# Altium schematic sheet Schematic_1.SchDoc: Hot End Extension Board
size 431 x 279 mm; DocumentNumber: 0FD2324801; SheetNumber: 1; SheetTotal: 1
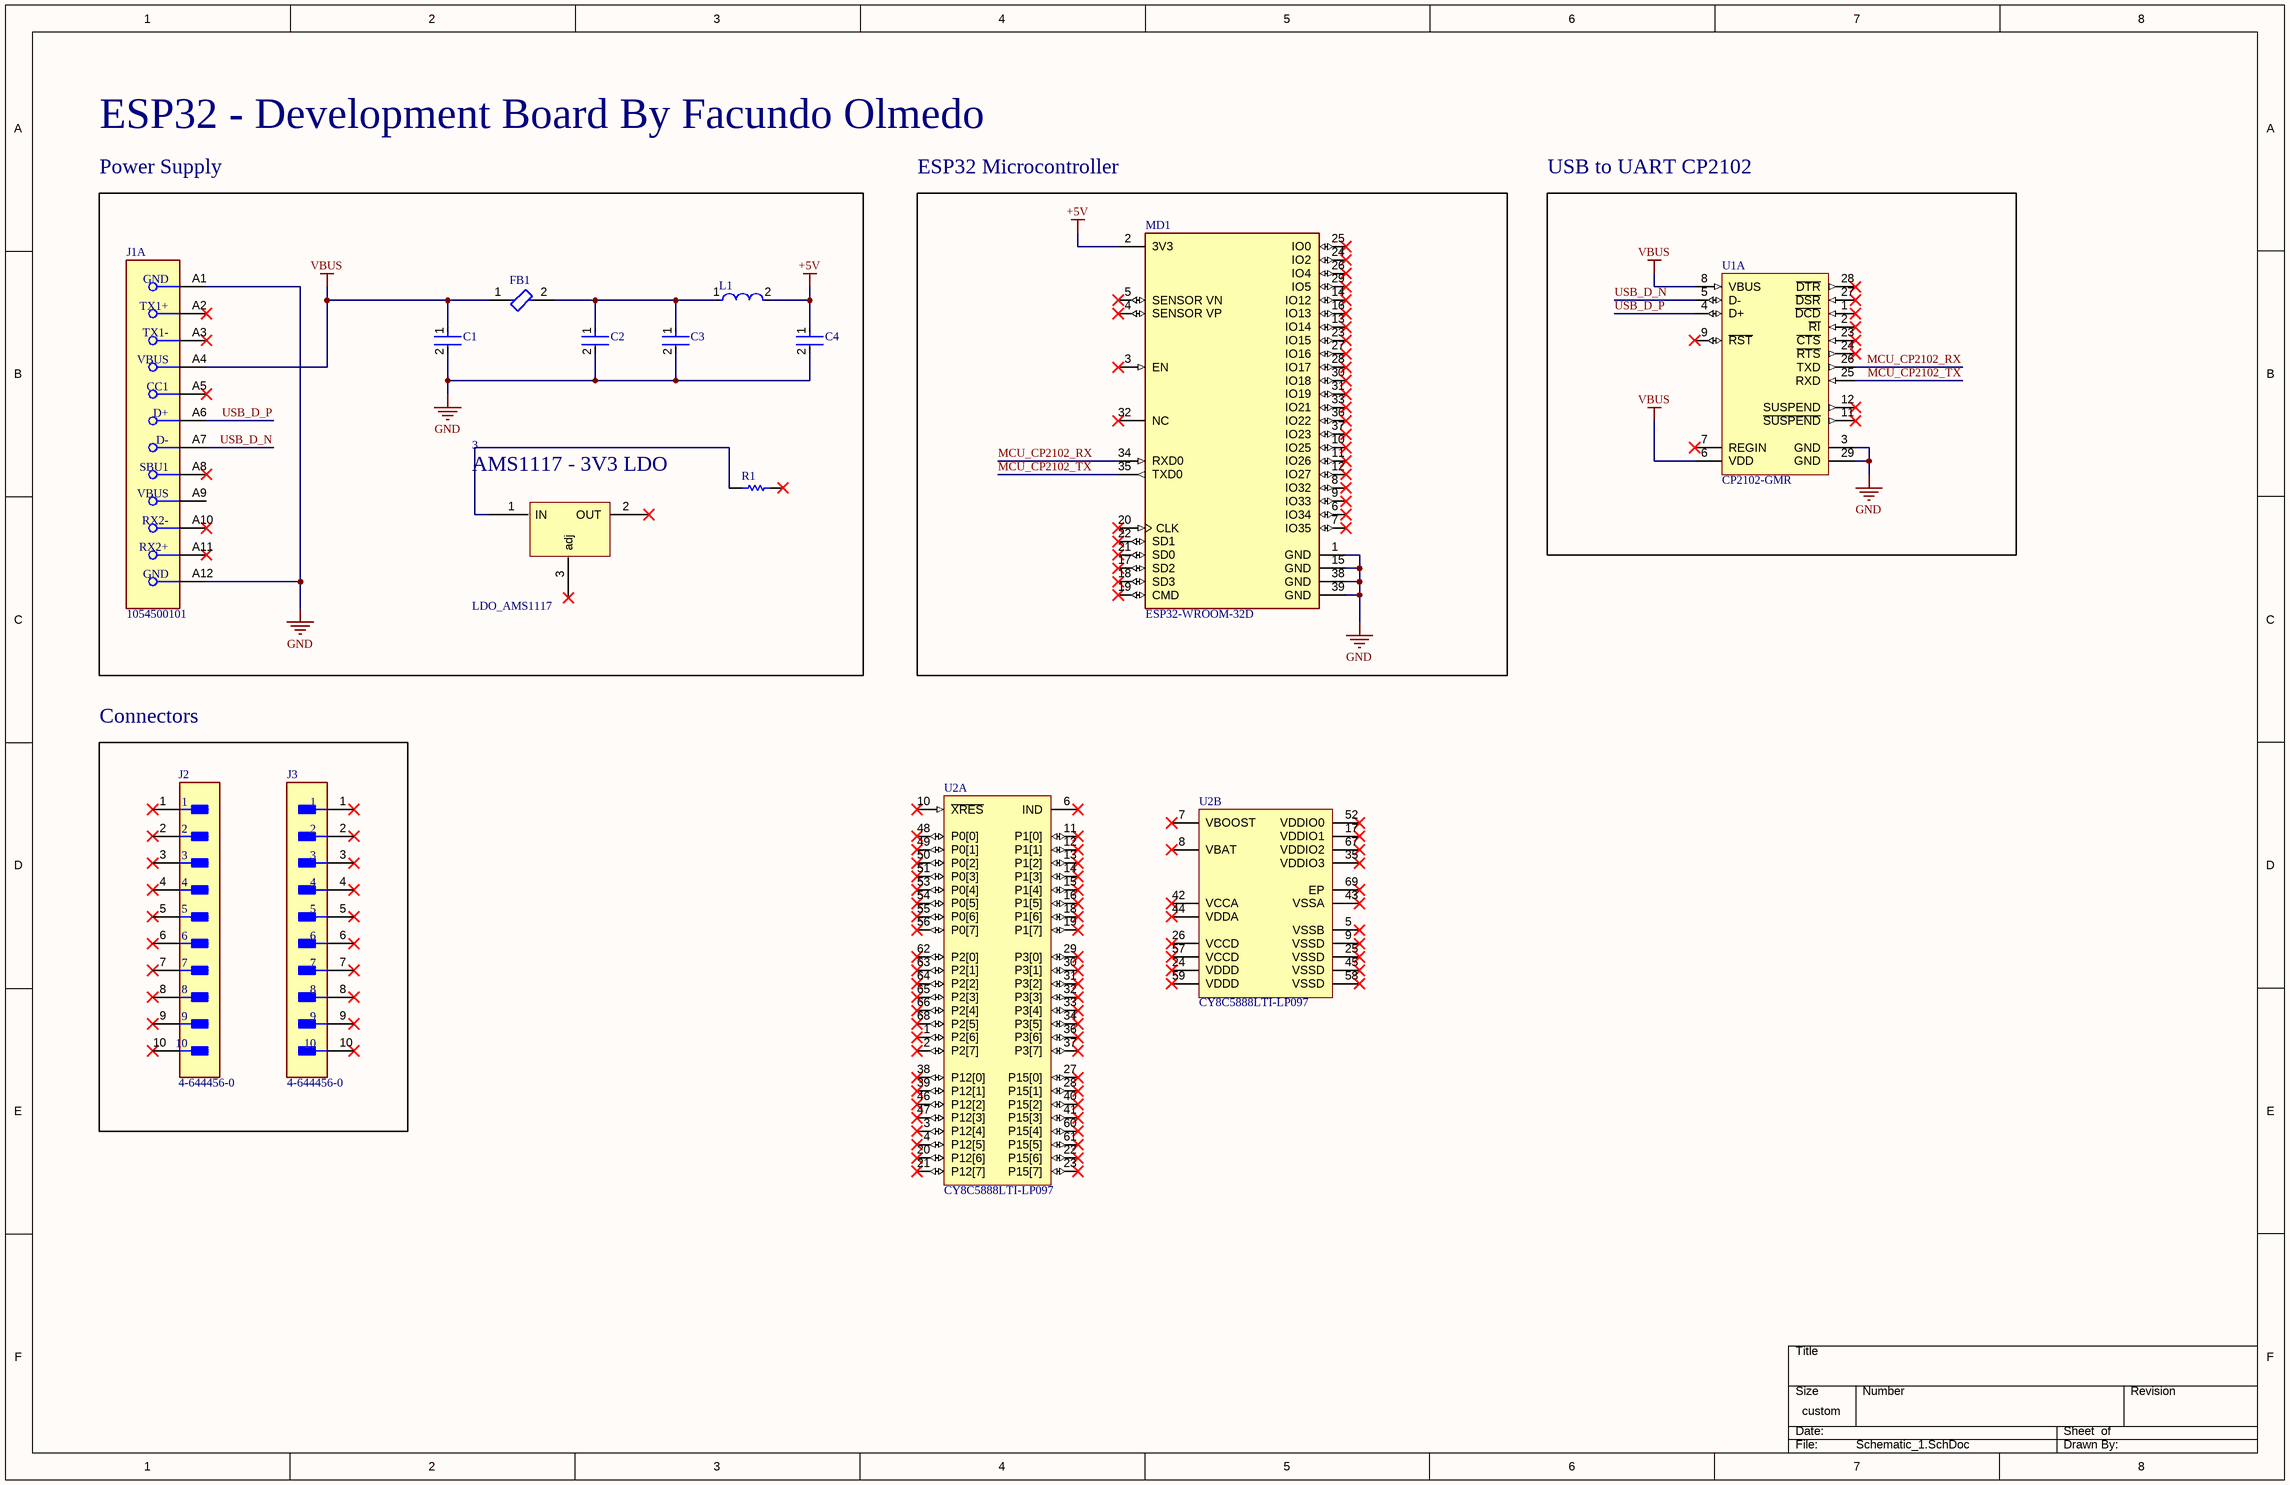
[diagram p0: Schematic_1.SchDoc]

## Parts
3  LDO_AMS1117  [PCBComponent_1]
C1  C0805C104K5RACTU  [FP-C0805C-DN-MFG]  (value not drawn)
C2  C0805C104K5RACTU  [FP-C0805C-DN-MFG]  (value not drawn)
C3  C0805C104K5RACTU  [FP-C0805C-DN-MFG]  (value not drawn)
C4  C0805C104K5RACTU  [FP-C0805C-DN-MFG]  (value not drawn)
FB1  BLM15AG102SN1D  [FP-BLM15-0_05-IPC_B]  (value not drawn)
J1  1054500101  [FP-1054500101-MFG]  (part A of 3)
J2  4-644456-0  [FP-4-644456-0-MFG]
J3  4-644456-0  [FP-4-644456-0-MFG]
L1  LQM21NNR10K10D  [FP-LQM21DN_00-IPC_A]  (value not drawn)
MD1  ESP32-WROOM-32D  [FP-ESP32-WROOM-32D-MFG]
R1  RC0805FR-0710RL  [RESC2013X60X35ML10T20]  (value not drawn)
U1  CP2102-GMR  [SLAB-QFN-28-3125x3125TP_M]  (part A of 2)
U2  CY8C5888LTI-LP097  [CYP-LTX68_M]  (parts A,B of 2)

## Blocks framed on the sheet
Power Supply: 3 C1-C4 FB1 J1 L1 R1
ESP32 Microcontroller: MD1
USB to UART CP2102: U1
Connectors: J2 J3

## Nets
+5V: C4.1 L1.2 MD1.2(3V3)
GND: C1.2 C2.2 C3.2 C4.2 J1.A1(GND) J1.A12(GND) MD1.1(GND) MD1.15(GND) MD1.38(GND) MD1.39(GND) U1.3(GND) U1.29(GND)
VBUS: C1.1 FB1.1 J1.A4(VBUS) U1.6(VDD) U1.8(VBUS)
MCU_CP2102_RX: MD1.34(RXD0) U1.26(TXD)
MCU_CP2102_TX: MD1.35(TXD0) U1.25(RXD)
USB_D_N: J1.A7(D-) U1.5(D-)
USB_D_P: J1.A6(D+) U1.4(D+)
Net3_1: 3.1(IN) R1.1
NetC2_1: C2.1 C3.1 FB1.2 L1.1

Not connected (* = marked no-connect by the designer): 3 2(OUT) 3(adj)*; J1 A2(TX1+)* A3(TX1-)* A5(CC1)* A8(SBU1)* A9(VBUS) A10(RX2-)* A11(RX2+)*; J2 1* 2* 3* 4* 5* 6* 7* 8* 9* 10*; J3 1* 2* 3* 4* 5* 6* 7* 8* 9* 10*; MD1 3(EN)* 4(SENSOR_VP)* 5(SENSOR_VN)* 6(IO34)* 7(IO35)* 8(IO32)* 9(IO33)* 10(IO25)* 11(IO26)* 12(IO27)* 13(IO14)* 14(IO12)* 16(IO13)* 17(SD2)* 18(SD3)* 19(CMD)* 20(CLK)* 21(SD0)* 22(SD1)* 23(IO15)* 24(IO2)* 25(IO0)* 26(IO4)* 27(IO16)* 28(IO17)* 29(IO5)* 30(IO18)* 31(IO19)* 32(NC)* 33(IO21)* 36(IO22)* 37(IO23)*; R1 2*; U1 1(~{DCD})* 2(~{RI})* 7(REGIN)* 9(~{RST})* 11(~{SUSPEND})* 12(SUSPEND)* 23(~{CTS})* 24(~{RTS})* 27(~{DSR})* 28(~{DTR})*; U2 1(P2[6])* 2(P2[7])* 3(P12[4])* 4(P12[5])* 5(VSSB)* 6(IND)* 7(VBOOST)* 8(VBAT)* 9(VSSD)* 10(~{XRES})* 11(P1[0])* 12(P1[1])* 13(P1[2])* 14(P1[3])* 15(P1[4])* 16(P1[5])* 17(VDDIO1)* 18(P1[6])* 19(P1[7])* 20(P12[6])* 21(P12[7])* 22(P15[6])* 23(P15[7])* 24(VDDD)* 25(VSSD)* 26(VCCD)* 27(P15[0])* 28(P15[1])* 29(P3[0])* 30(P3[1])* 31(P3[2])* 32(P3[3])* 33(P3[4])* 34(P3[5])* 35(VDDIO3)* 36(P3[6])* 37(P3[7])* 38(P12[0])* 39(P12[1])* 40(P15[2])* 41(P15[3])* 42(VCCA)* 43(VSSA)* 44(VDDA)* 45(VSSD)* 46(P12[2])* 47(P12[3])* 48(P0[0])* 49(P0[1])* 50(P0[2])* 51(P0[3])* 52(VDDIO0)* 53(P0[4])* 54(P0[5])* 55(P0[6])* 56(P0[7])* 57(VCCD)* 58(VSSD)* 59(VDDD)* 60(P15[4])* 61(P15[5])* 62(P2[0])* 63(P2[1])* 64(P2[2])* 65(P2[3])* 66(P2[4])* 67(VDDIO2)* 68(P2[5])* 69(EP)*

## Notes on the sheet
- ESP32 - Development Board By Facundo Olmedo
- DWG. NO.
- REV.
- SHT.
- THIS DOCUMENT AND THE DATA DISCLOSED HEREIN OR HEREWITH IS THE PROPERTY OF ALTIUM LIMITED AND MAY BE FREELY DISTRIBUTED IN WHOLE. NO RIGHTS ARE RESERVED OR EXPRESS OR IMPLIED WARANTEE GIVEN.
- REVISION
- DESCRIPTION
- DATE
- APPROVED
- ENG:
- APPROVALS
- PROJECT
- DSN:
- CHK:
- REFERENCE DOCUMENTS
- PROJECT REVISION:
- TITLE
- DOCUMENT REVISION:
- DESIGN ITEM:
- BOM:
- FAB DWG:
- PCB DWG:
- ASSY DWG:
- SCALE:
- SIZE
- B
- CAGE CODE
- FILE NAME
- DWG NO.
- SHEET
- OF
- REV
- (in symbol LDO_AMS1117) AMS1117 - 3V3 LDO

## Library data of the parts
C1-C4 = CMP-2007-00279-2: CAP CER 0.1UF 50V X7R 0805; Manufacturer: KEMET; Value: 0.10 μF; Tolerance: 0.1; Temperature Coefficient: 30ppm/°C; Material: Ceramic; Manufacturer Part Number: C0805C104K5RACTU; Device Class L2: Capacitors; Temperature Range Low: -55°C; Voltage Rating: 50 V; Digikey Description: CAP CER 0.1UF 50V X7R 0805; Category: Cap; ComponentLink2Description: Datasheet; Octopart: https://octopart.com/c0805c104k5ractu-kemet-143926; RoHS: TRUE; ComponentLink2URL: https://content.kemet.com/datasheets/KEM_C1003_C0G_SMD.pdf; Temperature Characteristic: X7R; Temperature: -55°C to +125°C; Height: 0.88mm; Temperature Range High: +125°C; Device Class L1: Passive Components; Automotive: No; Lead Free: Yes; Ipc Land Pattern Name: CAPC200125X78; Device Class L3: Ceramic Capacitors; Mouser Description: Cap Ceramic 0.1uF 50V X7R 10% SMD 2.0 x 1.2 mm 125 C Paper T/R; Capacitance: 0.10 μF; Package: C0805C-DN
FB1 = CMP-0686-00181-5: Chip Ferrite Bead, 0402, 1000Ω @ 100MHz, 0.65Ω, 25%, 300mA; DC Current: 200mA; Number of Circuits: 1; Shielding: Unshielded; Impedance: 1kR; DC Resistance (DCR): 650mR; DC Resistance-Max: 1R; Packaging: Tape and Reel; Case Code (Imperial): 0402; Military Standard: Not; Min Operating Temperature: -55°C; Width: 0.5mm; Tolerance: 25%; Material: Ferrite; Number of Lines: 1; Max Current Rating: 300mA; Depth: 0.55mm; Package Quantity: 1; Case/Package: 0402; Series: BLM15AG_SN; Case Code (Metric): 1005; Max Operating Temperature: 125°C; Lead Free: Lead Free; Test Frequency: 100MHz; RoHS Compliant: Yes; Radiation Hardening: No; Number of Pins: 2; Core Material: Ferrite; Current Rating: 300mA; Frequency: 100MHz; Max DC Current: 200mA; REACH SVHC: No SVHC; Length: 1mm; Termination: SMD/SMT; Height: 0.5mm
J1 = CMP-04767-000004-1: CONN RCP USB3.1 TYPEC 24P SMD RA; Manufacturer: Molex; Number Of Contacts: 24; Voltage Rating: 30V; Shielding: true; Is Female: yes; Current Rating: 0.25/1.25/5A; Pitch: 0.5mm; Conn Orientation: Right Angle; Package: 0; Height: 3.44mm; Footprint Url: https://www.molex.com/pdm_docs/sd/1054500101_sd.pdf; Device Class L1: Connectors; Category: Conn; Device Class L2: USB Connectors; Digikey Description: CONN RCP USB3.1 TYPEC 24P SMD RA; Contact Material: Gold,Nickel; Mouser Description: USB Shielded I/O Receptacle; Type C; Right Angle; Surface Mount; Gold over Nickel; ComponentLink2Description: Datasheet; Lead Free: Yes; Automotive: No; Temperature Range High: +85°C; RoHS: TRUE; Octopart: https://octopart.com/105450-0101-molex-68082325; ComponentLink2URL: https://www.molex.com/webdocs/datasheets/pdf/en-us/1054500101_IO_CONNECTORS.pdf; Temperature: -30°C to +85°C; Usb Standard: USB 3.1; Temperature Range Low: -30°C; Device Class L3: unset; Manufacturer Part Number: 1054500101
J2 J3 = CMP-03369-000038-1: CONN HEADER VERT 10POS 2.54MM; Manufacturer: TE Connectivity; Current Rating: 5A; Conn Gender: Male; Number Of Contacts: 10; Conn Orientation: Vertical; Voltage Rating: 250V; Number Of Rows: 1; Device Class L3: unset; Octopart: https://octopart.com/4-644456-0-te+connectivity-39514173; Pitch: 2.54mm; Mouser Description: Headers & Wire Housings NARROW FLT HDR 10P Straight Post; ComponentLink2Description: Datasheet; Height: 0.408inch; Package: 4-644456-0; RoHS: TRUE; Temperature Range High: +105°C; Digikey Description: CONN HEADER VERT 10POS 2.54MM; Temperature: -55°C to +105°C; Device Class L2: Headers and Wire Housings; Automotive: No; Lead Free: Yes; Contact Material: Tin; Manufacturer Part Number: 4-644456-0; Temperature Range Low: -55°C; Footprint Url: https://www.te.com/commerce/DocumentDelivery/DDEController?Action=showdoc&DocId=Customer+Drawing%7F644456%7FD2%7Fpdf%7FEnglish%7FENG_CD_644456_D2.pdf%7F4-644456-0; Device Class L1: Connectors; Category: Conn; ComponentLink2URL: https://www.te.com/commerce/DocumentDelivery/DDEController?Action=showdoc&DocId=Data+Sheet%7F82056_MTA%7F0818%7Fpdf%7FEnglish%7FENG_DS_82056_MTA_0818.pdf%7F4-644456-0
L1 = CMP-2000-06588-2: Multilayer Type Inductor for General Circuits, 0805 (2012), 0.1μH, 10%, 0.26Ω, 250mA; Test Frequency: 25MHz; Inductance: 100nH; Q Factor: 20; Self Resonant Frequency: 340MHz; Shielding: Shielded; Core Material: Ferrite; DC Resistance (DCR): 260mR; Rated Current-Max: 250mA; Tolerance: 10%; DC Current: 250mA; REACH SVHC: No SVHC; Case/Package: 0805; Package Quantity: 4000; Height - Seated (Max): 0.057inch; Packaging: Tape and Reel; Termination: SMD/SMT; RoHS Compliant: Yes; Series: LQM21N; Height: 0.85mm; Case Code (Metric): 2012; Width: 1.25mm; Inductance Tolerance: 10%; Case Code (Imperial): 0805; Radiation Hardening: No; Lead Free: Lead Free; Min Operating Temperature: -40°C; Current Rating: 250mA; Mount: Surface Mount; Max Operating Temperature: 85°C; Length: 2mm; Military Standard: Not; Max DC Current: 250mA; Depth: 1.45mm
MD1 = CMP-194065-000003-1: WIFI MODULE 32MBITS SPI FLASH; Manufacturer: Espressif Systems; Max Supply Voltage: 3.6V; Nominal Supply Current: 500mA; Max Frequency: 2484MHz; Number Of Adc Channels: 16; Number Of Gpio: 32; Interface: I2C,SPI,UART,Ethernet,I2S,Other; Data Rate: 150Mbits/s; Min Supply Voltage: 3V; Bandwidth: 72MHz; Sensitivity: -98dBm; Octopart: https://octopart.com/esp32-wroom-32d-espressif+systems-91040050; Package: ESP32-WROOM-32D; ComponentLink2URL: https://www.espressif.com/sites/default/files/documentation/esp32-wroom-32d_esp32-wroom-32u_datasheet_en.pdf; Lead Free: Yes; Category: UNK; Mouser Description: Wi-Fi/BT BLE Module ESP32-D0WD, SPI Flash, UART, P; Device Class L1: Integrated Circuits (ICs); RoHS: TRUE; Temperature Range Low: -40°C; ComponentLink2Description: Datasheet; Digikey Description: WIFI MODULE 32MBITS SPI FLASH; Height: 3.2mm; Temperature: -40°C to +85°C; Manufacturer Part Number: ESP32-WROOM-32D; Device Class L3: Transceivers; Device Class L2: RF Semiconductors and Devices; Temperature Range High: +85°C; Automotive: No
R1 = CMP-2100-03670-1: Chip Resistor, 10 Ohm, +/- 1%, 0.125 W, -55 to 155 degC, 0805 (2012 Metric), RoHS, Tape and Reel; Manufacturer: Yageo; Resistance: 10Ohm; Power Rating: 125mW; Voltage Rating: 150V; Temperature Coefficient: 200ppm/degreesC; Number of Pins: 2; REACH SVHC: NoSVHC; Datasheet Version: Rev. 5, 10/2016; Max Operating Temperature: 155degC; Manufacturer URL: http://www.yageo.com/; Case Code (Imperial): 0805; Package Description: 2-Pin Surface Mounted Device, Body 2 x 1.25 mm; Case Code (Metric): 2012; Length: 2mm; RoHSCompliant: true; Max Power Dissipation: 125mW; Depth: 1.25mm; Packaging: TapeandReel; Height: 0.5mm; Package Reference: 0805; Package Quantity: 1; Tolerance: 1%; Termination: SMD/SMT; Min Operating Temperature: -55degC; Lead Free: LeadFree; Width: 1.25mm; Voltage Rating (DC): 150V; Datasheet URL: http://www.yageo.com/NewPortal/yageodocoutput?fileName=/pdf/R-Chip/PYu-RC_Group_51_RoHS_L_5.pdf; Composition: ThickFilm; Number of Terminations: 2; Case/Package: 0805
U1 = CMP-2000-04924-1: Single-Chip USB to URAT Bridge, 3.3 V, -40 to 85 degC, 28-Pin QFN, RoHS, Tape and Reel; Manufacturer: Silicon Labs; Interface Circuit Standard 1: RS-232; Transmitter and Receiver FIFO Counter: No; Supply Current: 26mA; Operating Supply Voltage (Min): 3V; Operating Supply Voltage (Typ): 3.3V; Data Rate: 1000kbps; Operating Supply Voltage (Max): 3.6V; Number of Channels: 1; Package URL: http://www.silabs.com/Support%20Documents/TechnicalDocs/C8051T61x.pdf; Operating Temperature (Max): 85C; Datasheet URL: http://www.mouser.com/ds/2/368/CP2102-9-247052.pdf; Operating Temperature Classification: Industrial; Operating Temperature (Min): -40C; Package Description: 28-Pin Quad-Flat No-Leads Package, Body 5 x 5 mm, Pitch 0.5 mm; Manufacturer URL: http://www.silabs.com/; Rad Hardened: No; Package Reference: QFN-28; Pin Count: 28; Packaging: TapeandReel; Mounting: SurfaceMount; Package Type: QFNEP; Datasheet Version: Rev. 1.6, 12/2013
U2 = CMP-1003-00013-1: PSoC Programmable System-on-Chip, 256 KB Flash, 38 GPIOs, 1.71 to 5.5 V, 68-Pin QFN (LTX68), Tray; Manufacturer: Cypress; Flash (KB): 256; No. of GPIOs: 38; SRAM (KB): 64; CPU Core: ARM Cortex-M3; Min. Operating Voltage (V): 1.71; Max. Operating Frequency (MHz): 80; Max. Operating Voltage (V): 5.5; PartNumber: CY8C5888LTI-LP097; Mounting Technology: Surface Mount; ComponentLink3Description: Package Specification; Min. Operating Temp. (degreesC): -40; ComponentLink1Description: Manufacturer URL; ComponentLink2URL: http://www.cypress.com/?docID=47570; ComponentLink1URL: http://www.cypress.com/; Max. Operating Temp. (degreesC): 85; ComponentLink3URL: http://www.cypress.com/?docID=38892; DatasheetVersion: Rev. *E; Code_JEDEC: MO-220; PackageDescription: 68-Pin Quad Flat No Lead, Body 8.00 x 8.00 mm, Pitch 0.40 mm; PackageVersion: Rev. *E, 07/2012; ComponentLink2Description: Datasheet; Packing: Tray; PackageReference: LTX68